# Altium schematic sheet POWER_MOD.SchDoc
size A4
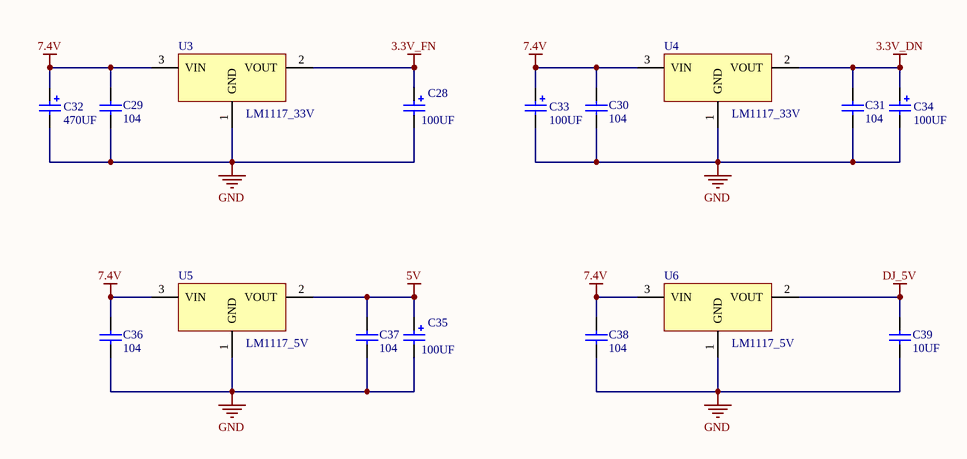
[diagram p0: POWER_MOD.SchDoc]

## Parts
C28  100UF  [7343]
C29  104  [0805]
C30  104  [0805]
C31  104  [0805]
C32  470UF  [tie pian 470uf 10*10.3]
C33  100UF  [tiepian 100uf 6*7]
C34  100UF  [tiepian 100uf 6*7]
C35  100UF  [tiepian 100uf 6*7]
C36  104  [0805]
C37  104  [0805]
C38  104  [0805]
C39  10UF  [1206]
U3  LM1117_33V  [SOT-223]
U4  LM1117_33V  [SOT-223]
U5  LM1117_5V  [SOT-223]
U6  LM1117_5V  [SOT-223]

## Nets
3.3V_DN: C31.1 C34.1 U4.2(VOUT)
3.3V_FN: C28.1 U3.2(VOUT)
5V: C35.1 C37.1 U5.2(VOUT)
7.4V: C29.1 C30.1 C32.1 C33.1 C36.1 C38.1 U3.3(VIN) U4.3(VIN) U5.3(VIN) U6.3(VIN)
DJ_5V: C39.1 U6.2(VOUT)
GND: C28.2 C29.2 C30.2 C31.2 C32.2 C33.2 C34.2 C35.2 C36.2 C37.2 C38.2 C39.2 U3.1(GND) U4.1(GND) U5.1(GND) U6.1(GND)

## Library data of the parts
C28 C32-C35 = Cap Pol1
C29-C31 C36-C39 = Cap
U3 U4 = LM1117_5V